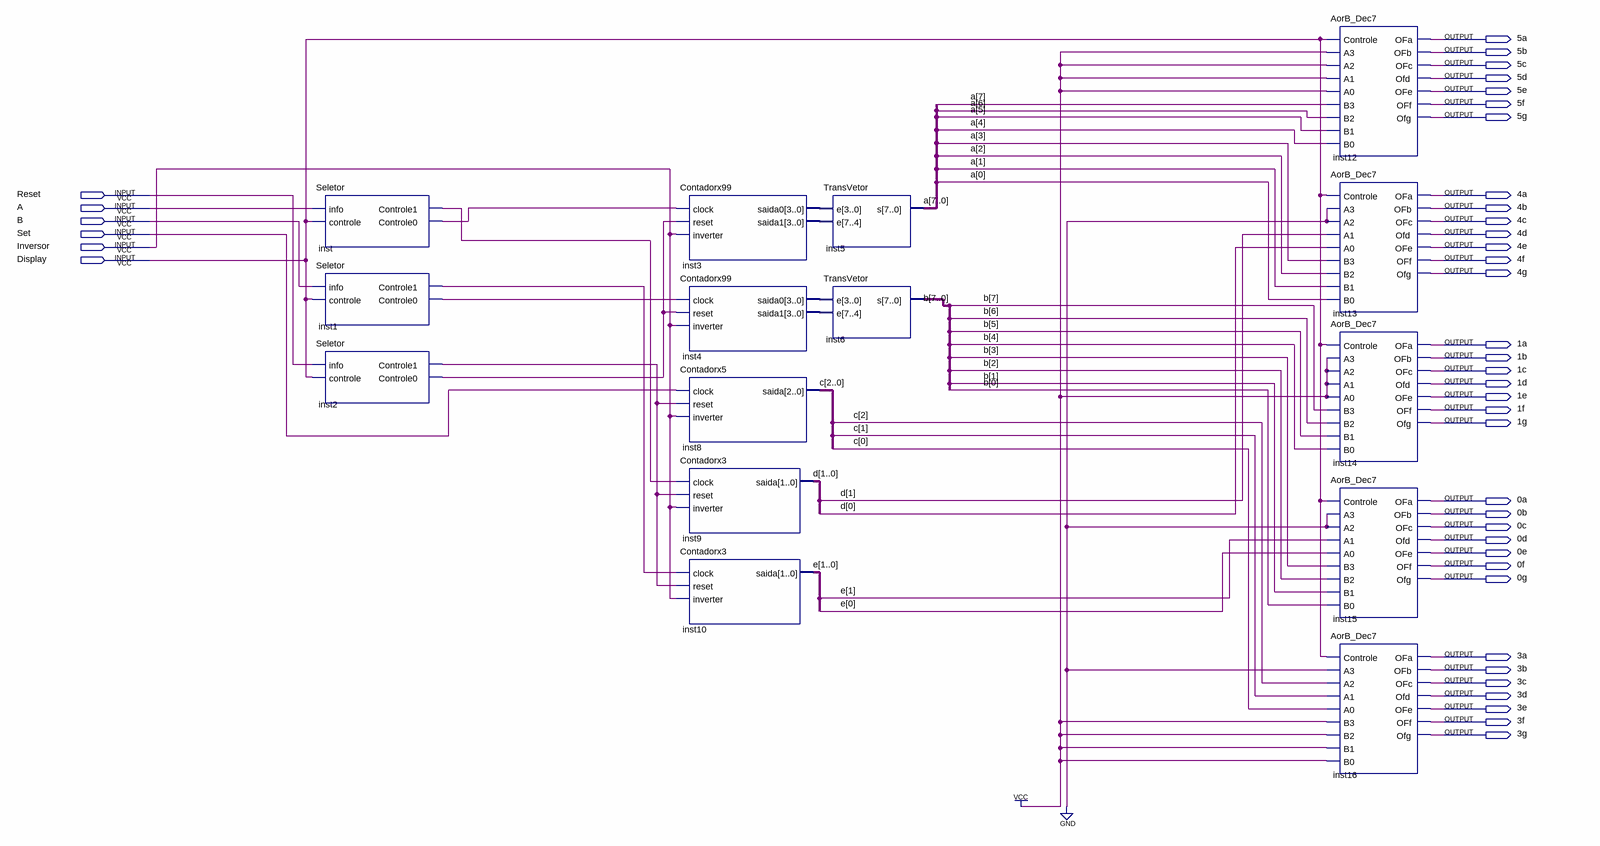
[diagram p0: schematic sheet]
// Quartus schematic Placar_Volei.bdf as structural Verilog: 15 symbols, 41 pins
module Placar_Volei (
  input  Reset,
  input  A,
  input  B,
  input  Set,
  input  Inversor,
  input  Display,
  output \5a ,
  output \5b ,
  output \5c ,
  output \5d ,
  output \5e ,
  output \5f ,
  output \5g ,
  output \4a ,
  output \4b ,
  output \4c ,
  output \4d ,
  output \4e ,
  output \4f ,
  output \4g ,
  output \1a ,
  output \1b ,
  output \1c ,
  output \1d ,
  output \1e ,
  output \1f ,
  output \1g ,
  output \0a ,
  output \0b ,
  output \0c ,
  output \0d ,
  output \0e ,
  output \0f ,
  output \0g ,
  output \3a ,
  output \3b ,
  output \3c ,
  output \3d ,
  output \3e ,
  output \3f ,
  output \3g 
);

  wire inst1_controle0, inst1_controle1, inst2_controle0, inst2_controle1, inst_controle0, inst_controle1;
  wire [1:0] d, e;
  wire [2:0] c;
  wire [3:0] inst3_saida0, inst3_saida1, inst4_saida0, inst4_saida1;
  wire [7:0] A_bus, B_bus;

  Seletor inst (.info(A), .controle(Display), .Controle1(inst_controle1), .Controle0(inst_controle0));
  Seletor inst1 (.info(B), .controle(Display), .Controle1(inst1_controle1), .Controle0(inst1_controle0));
  Seletor inst2 (.info(Reset), .controle(Display), .Controle1(inst2_controle1), .Controle0(inst2_controle0));
  Contadorx99 inst3 (
    .clock(inst_controle0), .reset(inst2_controle0), .inverter(Inversor), .saida0(inst3_saida0),
    .saida1(inst3_saida1));
  Contadorx99 inst4 (
    .clock(inst1_controle0), .reset(inst2_controle0), .inverter(Inversor), .saida0(inst4_saida0),
    .saida1(inst4_saida1));
  Contadorx5 inst8 (.clock(Set), .reset(inst2_controle1), .inverter(Inversor), .saida(c));
  Contadorx3 inst9 (.clock(inst_controle1), .reset(inst2_controle1), .inverter(Inversor), .saida(d));
  Contadorx3 inst10 (.clock(inst1_controle1), .reset(inst2_controle1), .inverter(Inversor), .saida(e));
  TransVetor inst5 (.e({inst3_saida1, inst3_saida0}), .s(A_bus));
  TransVetor inst6 (.e({inst4_saida1, inst4_saida0}), .s(B_bus));
  AorB_Dec7 inst12 (
    .Controle(Display), .A3(1'b1), .A2(1'b1), .A1(1'b1), .A0(1'b1), .B3(A_bus[7]), .B2(A_bus[6]),
    .B1(A_bus[5]), .B0(A_bus[4]), .OFa(\5a ), .OFb(\5b ), .OFc(\5c ), .Ofd(\5d ), .OFe(\5e ), .OFf(\5f ),
    .Ofg(\5g ));
  AorB_Dec7 inst13 (
    .Controle(Display), .A3(1'b0), .A2(1'b0), .A1(d[1]), .A0(d[0]), .B3(A_bus[3]), .B2(A_bus[2]),
    .B1(A_bus[1]), .B0(A_bus[0]), .OFa(\4a ), .OFb(\4b ), .OFc(\4c ), .Ofd(\4d ), .OFe(\4e ), .OFf(\4f ),
    .Ofg(\4g ));
  AorB_Dec7 inst14 (
    .Controle(Display), .A3(1'b1), .A2(1'b1), .A1(1'b1), .A0(1'b1), .B3(B_bus[7]), .B2(B_bus[6]),
    .B1(B_bus[5]), .B0(B_bus[4]), .OFa(\1a ), .OFb(\1b ), .OFc(\1c ), .Ofd(\1d ), .OFe(\1e ), .OFf(\1f ),
    .Ofg(\1g ));
  AorB_Dec7 inst15 (
    .Controle(Display), .A3(1'b0), .A2(1'b0), .A1(e[1]), .A0(e[0]), .B3(B_bus[3]), .B2(B_bus[2]),
    .B1(B_bus[1]), .B0(B_bus[0]), .OFa(\0a ), .OFb(\0b ), .OFc(\0c ), .Ofd(\0d ), .OFe(\0e ), .OFf(\0f ),
    .Ofg(\0g ));
  AorB_Dec7 inst16 (
    .Controle(Display), .A3(1'b0), .A2(c[2]), .A1(c[1]), .A0(c[0]), .B3(1'b1), .B2(1'b1), .B1(1'b1),
    .B0(1'b1), .OFa(\3a ), .OFb(\3b ), .OFc(\3c ), .Ofd(\3d ), .OFe(\3e ), .OFf(\3f ), .Ofg(\3g ));
endmodule
